# EAGLE design smartgarage (EAGLE 7.2.0)
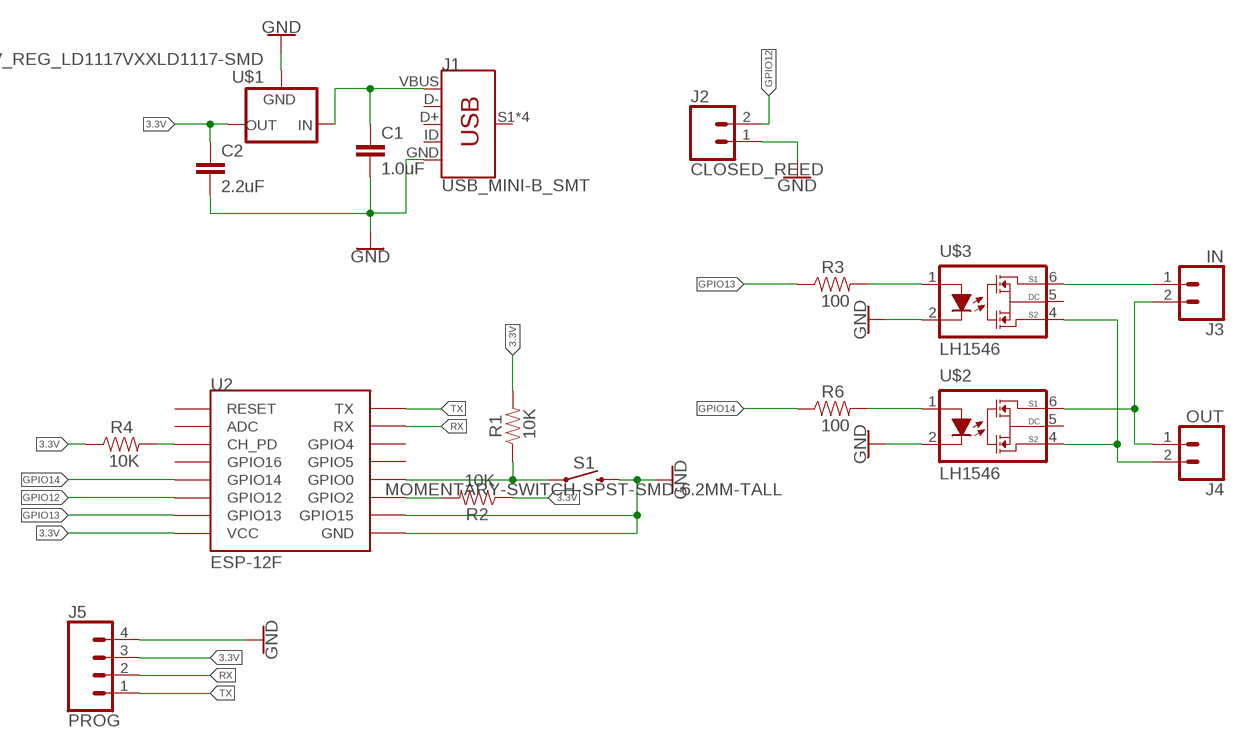
[diagram p0: schematic, sheet 1]

## Parts
C1  1.0uF  1.0UF-0805-25V-10%  [0805]
C2  2.2uF  2.2UF-0805-25V-(+80/-20%)  [0805]
J1  USB_MINI-B_SMT  [USB-MINIB]
J2  CLOSED_REED  CONN_023.5MM-NO_SILK  [SCREWTERMINAL-3.5MM-2-NS]
J3  IN  CONN_023.5MM-NO_SILK  [SCREWTERMINAL-3.5MM-2-NS]
J4  OUT  CONN_023.5MM-NO_SILK  [SCREWTERMINAL-3.5MM-2-NS]
J5  PROG  CONN_04  [1X04]
R1  10K  RESISTOR0805  [0805]
R2  10K  RESISTOR0805  [0805]
R3  100  RESISTOR0805  [0805]
R4  10K  RESISTOR0805  [0805]
R6  100  RESISTOR0805  [0805]
S1  MOMENTARY-SWITCH-SPST-SMD-6.2MM-TALL  [TACTILE_SWITCH_SMD_6.2MM_TALL]
U2  ESP-12F  ESP12SMD  [ESP12-SMD]
U$1  V_REG_LD1117VXXLD1117-SMD  [SOT223]
U$2  LH1546  [DIL6-SMD]
U$3  LH1546  [DIL6-SMD]

## Nets
3.3V: C2.1 J5.3 R1.2 R2.1 R4.1 U2.VCC U$1.2(OUT)
GND: C1.2 C2.2 J1.GND J2.1 J5.4 S1.B2 U2.GND U2.GPIO15 U$1.1(GND) U$2.2(C) U$3.2(C)
GPIO12: J2.2 U2.GPIO12
GPIO13: R3.1 U2.GPIO13
GPIO14: R6.1 U2.GPIO14
N$1: R1.1 S1.A2 U2.GPIO0
N$2: R6.2 U$2.1(A)
N$4: R4.2 U2.CH_PD
N$5: R2.2 U2.GPIO2
N$6: J3.2 J4.1 U$2.6(S1)
N$7: R3.2 U$3.1(A)
N$8: J3.1 U$3.6(S1)
N$9: J4.2 U$2.4(S2) U$3.4(S2)
RX: J5.2 U2.RXD0(RX)
TX: J5.1 U2.TXD0(TX)
VBUS: C1.1 J1.VBUS U$1.3(IN)
Unconnected: J1.D+ J1.D- J1.ID J1.S1(SHIELD) J1.S2(SHIELD) J1.S3(SHIELD) J1.S4(SHIELD) U2.ADC U2.GPIO4 U2.GPIO5 U2.GPIO16 U2.RESET U$2.5(DC) U$3.5(DC)

## Library data of the parts
C1 = SparkFun-Capacitors:1.0UF: 1µF ceramic capacitors A capacitor is a passive two-terminal electrical component used to store electrical energy temporarily in an electric field.; PROD_ID: CAP-08064
C2 = SparkFun-Capacitors:2.2UF: 2.2µF ceramic capacitors A capacitor is a passive two-terminal electrical component used to store electrical energy temporarily in an electric field.; PROD_ID: CAP-11624
J1 = SparkFun-Connectors:USB_MINI-B: USB type Mini-B Connector Breaks out 5th pin, and includes shield pins if needed. SparkFun Products: SparkFun FTDI Basic Breakout <https://www.sparkfun.com/products/9716> SparkFun XBee Explorer USB <https://www.sparkfun.com/products/11812> SparkFun Redboard <https://www.sparkfun.com/products/12757>; PROD_ID: CONN-08193; SF_ID: PRT-00587
J2-J4 = SparkFun-Connectors:CONN_02: Multi connection point. Often used as Generic Header-pin footprint for 0.1 inch spaced/style header connections On any of the 0.1 inch spaced packages, you can populate with these: Break Away Headers - Straight <https://www.sparkfun.com/products/116> (PRT-00116) Break Away Male Headers - Right Angle <https://www.sparkfun.com/products/553> (PRT-00553) Female Headers <https://www.sparkfun.com/products/115> (PRT-00115) Break Away Headers - Machine Pin <https://www.sparkfun.com/products/117> (PRT-00117) Break Away Female Headers - Swiss Machine Pin <https://www.sparkfun.com/products/743> (PRT-00743) For SCREWTERMINALS and SPRING TERMINALS visit here: Screw Terimnals on SparkFun.com <https://www.sparkfun.com/search/results?term=Screw+Terminals> (5mm/3.5mm/2.54mm spacing) This device is also useful as a general connection point to wire up your design to another part of your project. Our various solder wires solder well into these plated through hole pads. Hook-Up Wire - Assortment (Stranded, 22 AWG) <https://www.sparkfun.com/products/11375> (PRT-11375) Hook-Up Wire - Assortment (Solid Core, 22 AWG) <https://www.sparkfun.com/products/11367> (PRT-11367) View the entire wire category on our website here <https://www.sparkfun.com/categories/141> Special notes: Molex polarized connector foot print use with: PRT-08233 with associated crimp pins and housings. 2.54_SCREWTERM for use with PRT-10571. 3.5mm Screw Terminal footprints for PRT-08084 5mm Screw Terminal footprints for use with PRT-08432; PROD_ID: CONN-08399
J5 = SparkFun-Connectors:CONN_04: Multi connection point. Often used as Generic Header-pin footprint for 0.1 inch spaced/style header connections On any of the 0.1 inch spaced packages, you can populate with these: Break Away Headers - Straight <https://www.sparkfun.com/products/116> (PRT-00116) Break Away Male Headers - Right Angle <https://www.sparkfun.com/products/553> (PRT-00553) Female Headers <https://www.sparkfun.com/products/115> (PRT-00115) Break Away Headers - Machine Pin <https://www.sparkfun.com/products/117> (PRT-00117) Break Away Female Headers - Swiss Machine Pin <https://www.sparkfun.com/products/743> (PRT-00743) For SCREWTERMINALS and SPRING TERMINALS visit here: Screw Terimnals on SparkFun.com <https://www.sparkfun.com/search/results?term=Screw+Terminals> (5mm/3.5mm/2.54mm spacing) This device is also useful as a general connection point to wire up your design to another part of your project. Our various solder wires solder well into these plated through hole pads. Hook-Up Wire - Assortment (Stranded, 22 AWG) <https://www.sparkfun.com/products/11375> (PRT-11375) Hook-Up Wire - Assortment (Solid Core, 22 AWG) <https://www.sparkfun.com/products/11367> (PRT-11367) View the entire wire category on our website here <https://www.sparkfun.com/categories/141> Special notes: Molex polarized connector foot print use with SKU : PRT-08231 with associated crimp pins and housings. 1MM SMD Version SKU: PRT-10208; PROD_ID: CONN-09696
R1-R4 R6 = SparkFun-Resistors:RESISTOR: Generic Resistor Package
S1 = SparkFun-Switches:MOMENTARY-SWITCH-SPST: Momentary Switch (Pushbutton) - SPST Normally-open (NO) SPST momentary switches (buttons, pushbuttons). Variants PTH-12MM - 12mm square, through-hole Momentary Pushbutton Switch - 12mm Square <https://www.sparkfun.com/products/9190> (COM-09190) PTH-6.0MM, PTH-6.0MM-KIT - 6.0mm square, through-hole Mini Pushbutton Switch <https://www.sparkfun.com/products/97> (COM-00097) KIT package intended for soldering kit's - only one side of pads' copper is exposed. PTH-RIGHT-ANGLE-KIT - Right-angle, through-hole Right Angle Tactile Button <https://www.sparkfun.com/products/10791> - Used on SparkFun BigTime Watch Kit <https://www.sparkfun.com/products/11734> SMD-12MM - 12mm square, surface-mount Tactile Button - SMD (12mm) <https://www.sparkfun.com/products/12993> (COM-12993) Used on SparkFun PicoBoard <https://www.sparkfun.com/products/11888> SMD-4.5MM - 4.5mm Square Trackball Switch Used on SparkFun Blackberry Trackballer Breakout <https://www.sparkfun.com/products/13169> SMD-4.6MMX2.8MM - 4.60mm x 2.80mm, surface mount Used on SparkFun SAMD21 Mini Breakout <https://www.sparkfun.com/products/13664> SMD-5.2MM, SMD-5.2-REDUNDANT - 5.2mm square, surface-mount Mini Pushbutton Switch - SMD <https://www.sparkfun.com/products/8720> (COM-08720) Used on Arduino Pro Mini <https://www.sparkfun.com/products/11114> REDUNDANT package connects both switch circuits together SMD-6.0X3.5MM - 6.0 x 3.5mm, surface mount Momentary Reset Switch SMD <https://www.sparkfun.com/products/8229> (COM-08229) SMD-6.2MM-TALL - 6.2mm square, surface mount Tactile Button - SMD (6mm) <https://www.sparkfun.com/products/12992> Used on SparkFun Digital Sandbox <https://www.sparkfun.com/products/12651> SMD-RIGHT-ANGLE - Right-angle, surface mount Used on SparkFun Block for Intel® Edison - Arduino <https://www.sparkfun.com/products/13036>; PROD_ID: SWCH-11966; SF_SKU: COM-12992
U2 = esp8266modules:ESP12: ESP8266 Wifi module 12
U$1 = SparkFun-IC-Power:V_REG_LD1117VXX: LD1117VXX voltage regulator. We carry the 3.3V version (COM-00526) in TO-220 package.; PROD_ID: VREG-13917
U$2 U$3 = smartgarage:LH1546: Vishay Semiconductor Opto Division LH1546 https://www.digikey.com/product-detail/en/vishay-semiconductor-opto-division/LH1546AABTR/LH1546AABTRCT-ND/4895879

## Board
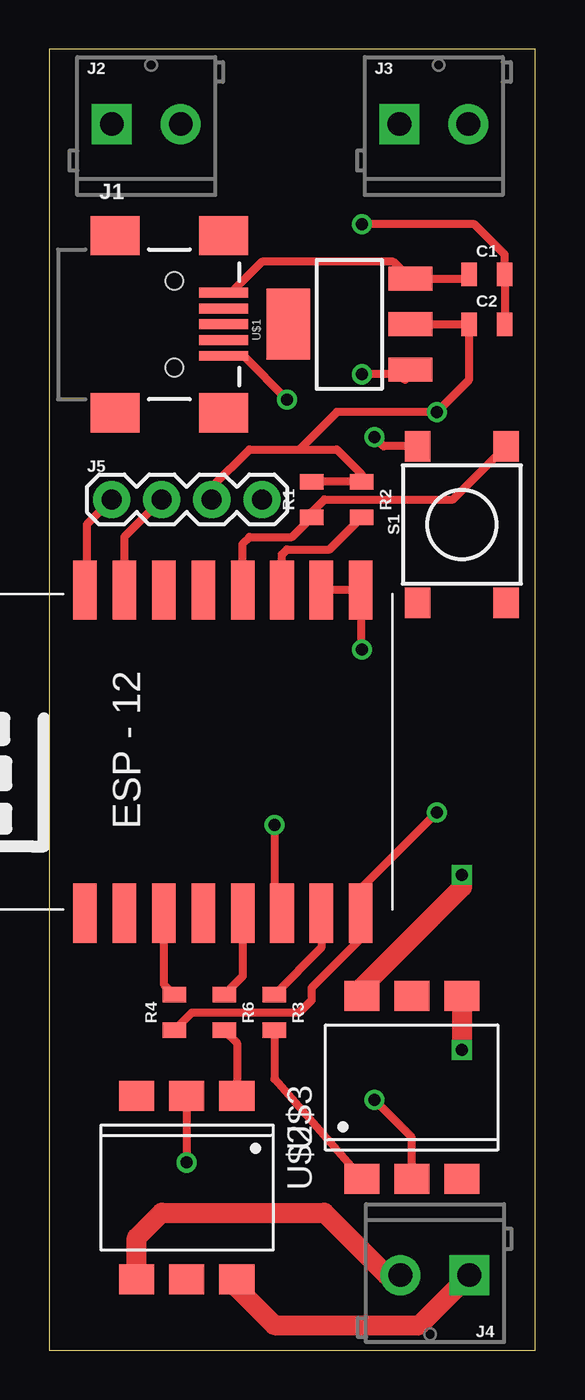
[diagram p1: board, top side]
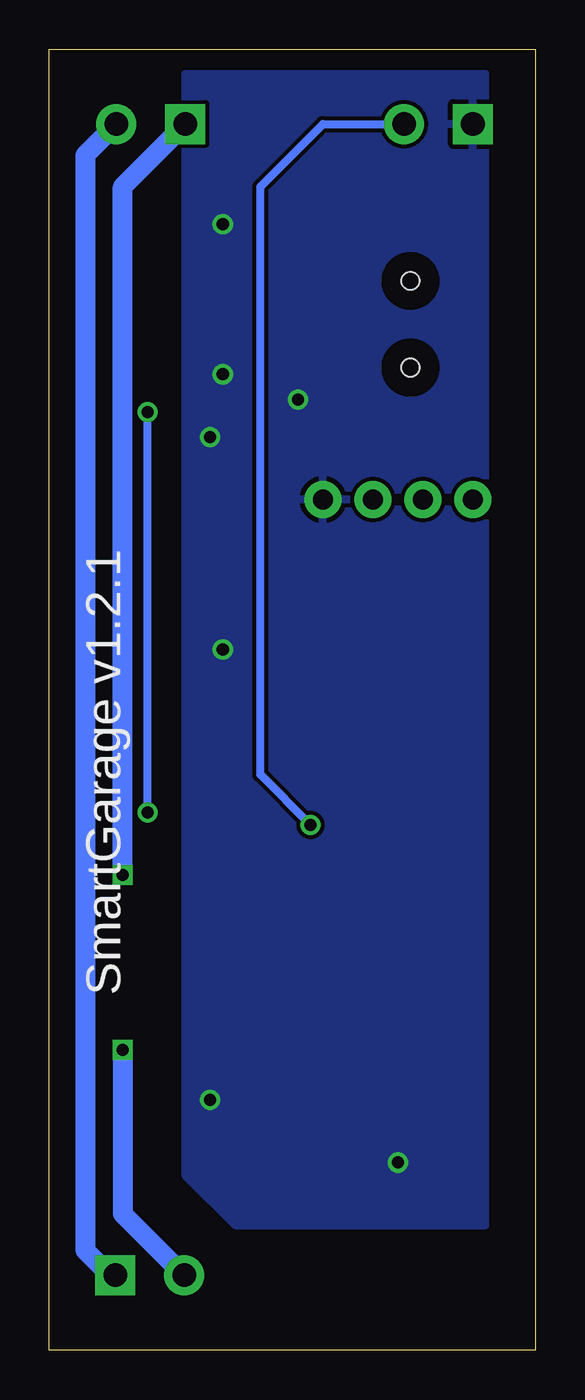
[diagram p2: board, bottom side, seen from below]

Size 24.69 x 66.03 mm. Coordinates in mm from the lower left corner, seen from the top.
Outline: 0,0 24.69,0 24.69,66.03 0,66.03 0,0
Copper layers (1*16): Top 0.035mm / dielectric 1.5mm / Bottom 0.035mm
Design rules "default": minimum track width 10mil, minimum drill 24mil, track to track 8mil, track to pad 8mil, pad to pad 8mil, via to via 8mil, smd to smd 8mil, copper to edge 40mil, drill to drill 8mil, minimum pad ring 10mil, minimum via ring 8mil, stop-mask expansion 4mil, vias tented up to drill 0mil, thermal gap 10mil

### Footprints (pad centres in the part's own frame; a part is rotated, then mirrored left to right if it is on the bottom)
0805 = smd 0.8 x 1.2: 1 -0.9,0; 2 0.9,0
USB-MINIB = smd 2.5 x 0.5: D+ 2.5,0; D- 2.5,0.8; GND 2.5,-1.6; ID 2.5,-0.8; VBUS 2.5,1.6 | smd 2.5 x 2: S1 -3,4.5; S2 2.5,4.5; S3 -3,-4.5; S4 2.5,-4.5 | hole 0.9: 0,2.2; 0,-2.2
SCREWTERMINAL-3.5MM-2-NS = drill 1.2 pad 2.032 square: 1 0,0 | drill 1.2 pad 2.032: 2 3.5,0
1X04 = drill 1.016 pad 1.88: 1 0,0; 2 2.54,0; 3 5.08,0; 4 7.62,0
TACTILE_SWITCH_SMD_6.2MM_TALL = smd 1.55 x 1.3: A1 -3.975,-2.25; A2 3.975,-2.25; B1 -3.975,2.25; B2 3.975,2.25
ESP12-SMD = smd 3 x 1.2: ADC -8.3,3.8; CH_PD -8.3,1.8; GND 8.1,-8.2; GPIO0 8.1,-2.2; GPIO2 8.1,-4.2; GPIO4 8.1,1.8; GPIO5 8.1,-0.2; GPIO12 -8.3,-4.2; GPIO13 -8.3,-6.2; GPIO14 -8.3,-2.2; GPIO15 8.1,-6.2; GPIO16 -8.3,-0.2; RESET -8.3,5.8; RXD0 8.1,3.8; TXD0 8.1,5.8; VCC -8.3,-8.2
SOT223 = smd 1.219 x 2.235: 1 -2.311,-3.099; 2 0,-3.099; 3 2.311,-3.099 | smd 3.6 x 2.2: 4 0,3.099
DIL6-SMD = smd 1.78 x 1.52: 1 -2.54,-4.645; 2 0,-4.645; 3 2.54,-4.645; 4 2.54,4.645; 5 0,4.645; 6 -2.54,4.645

### Placement (x,y rotation side)
C1  22.23,54.61 0 top
C2  22.23,52.07 0 top
J1  6.35,52.07 0 top
J2  3.17,62.23 0 top
J3  17.78,62.23 0 top
J4  21.34,3.81 180 top
J5  3.17,43.18 0 top
R1  13.34,43.18 90 top
R2  15.88,43.18 270 top
R3  11.43,17.14 270 top
R4  6.35,17.14 90 top
R6  8.89,17.14 270 top
S1  20.95,41.91 90 top
U2  7.62,30.48 90 top
U$1  15.24,52.07 90 top
U$2  6.99,8.26 180 top
U$3  18.41,13.34 0 top

### Tracks (layer width: path | path; a pad name or v marks a point on that pad's centre or on a via)
3.3V  (via drill 0.61)
  Top 0.406: U$1.2 C2.1 21.32,49.27 v19.68,47.62 14.61,47.62 12.7,45.72 | R4.1 7.25,17.14 12.7,17.14 13.34,17.78 13.34,18.41 15.82,20.9 U2.VCC 15.82,23.44 v19.68,27.3 | R1.2 R2.1 15.88,44.45 14.61,45.72 12.7,45.72 | J5.3 8.26,43.81 10.16,45.72 12.7,45.72
  Bottom 0.406: v19.68,27.3 v19.68,47.62
GND  (via drill 0.61)
  Top 0.406: C2.2 C1.2 23.12,55.62 21.59,57.15 v15.88,57.15 | 17.78,49.53 18.09,49.84 18.26,49.84 U$1.1 18.57,49.53 19.05,49.53 | J1.GND 9.86,50.47 v12.06,48.26 | U2.GND U2.GPIO15 | 15.56,38.58 U2.GND | 17.78,49.53 v15.88,49.53 | U$3.2 18.41,10.79 v16.51,12.7 | U$2.2 v6.99,9.53 | U2.GND 15.82,35.62 v15.88,35.56 | U2.GND 15.82,38.84 | 18.07,49.24 17.78,49.53 | S1.B2 16.98,45.88 v16.51,46.35
  pour Bottom: 2.54,64.77 17.78,64.77 17.78,8.89 15.24,6.35 2.54,6.35
GPIO12  (via drill 0.61)
  Top 0.406: 11.43,22.43 U2.GPIO12 11.43,22.57 v11.43,26.67
  Bottom 0.406: 7.62,62.23 J2.2 10.79,62.23 13.97,59.05 13.97,29.21 v11.43,26.67
GPIO13
  Top 0.406: U2.GPIO13 13.82,20.43 R3.1
GPIO14
  Top 0.406: U2.GPIO14 9.82,18.98 R6.1
N$1
  Top 0.406: U2.GPIO0 9.82,40.94 10.16,41.27 12.33,41.27 R1.1 13.34,42.55 13.97,43.18 20.5,43.18 S1.A2
N$2
  Top 0.406: R6.2 9.53,15.61 U$2.1
N$4
  Top 0.406: U2.CH_PD 5.82,18.57 R4.2
N$5
  Top 0.406: U2.GPIO2 11.82,40.4 12.06,40.64 14.23,40.64 R2.2
N$6
  Top 1.016: U$2.6 9.53,3.17 11.43,1.27 18.8,1.27 J4.1
  Bottom 1.016: J3.2 22.86,60.65 22.86,5.08 21.59,3.81 J4.1
N$7
  Top 0.406: R3.2 11.43,13.77 U$3.1
N$8  (via drill 0.61)
  Top 1.016: U$3.6 15.88,18.41 20.95,23.5 v20.95,24.13
  Bottom 1.016: J3.1 20.95,59.05 v20.95,24.13
N$9  (via drill 0.61)
  Top 1.016: U$3.4 v20.95,15.24 | U$2.4 4.45,5.71 5.71,6.99 13.97,6.99 17.14,3.81 J4.2
  Bottom 1.016: v20.95,15.24 20.95,6.93 J4.2
RX
  Top 0.406: J5.2 3.81,41.27 U2.RXD0
TX
  Top 0.406: J5.1 1.91,41.91 1.91,38.66 U2.TXD0
VBUS
  Top 0.406: C1.1 21.1,54.38 U$1.3 17.48,55.24 10.79,55.24 9.22,53.67 J1.VBUS

### Text on the board
bPlace: SmartGarage v1.2.1